# Altium project UcusKarti.PrjPcb (part 2 of 2)

## Sheet STM32.SchDoc
size A3; DocumentNumber: 4; SheetNumber: 4; SheetTotal: 5
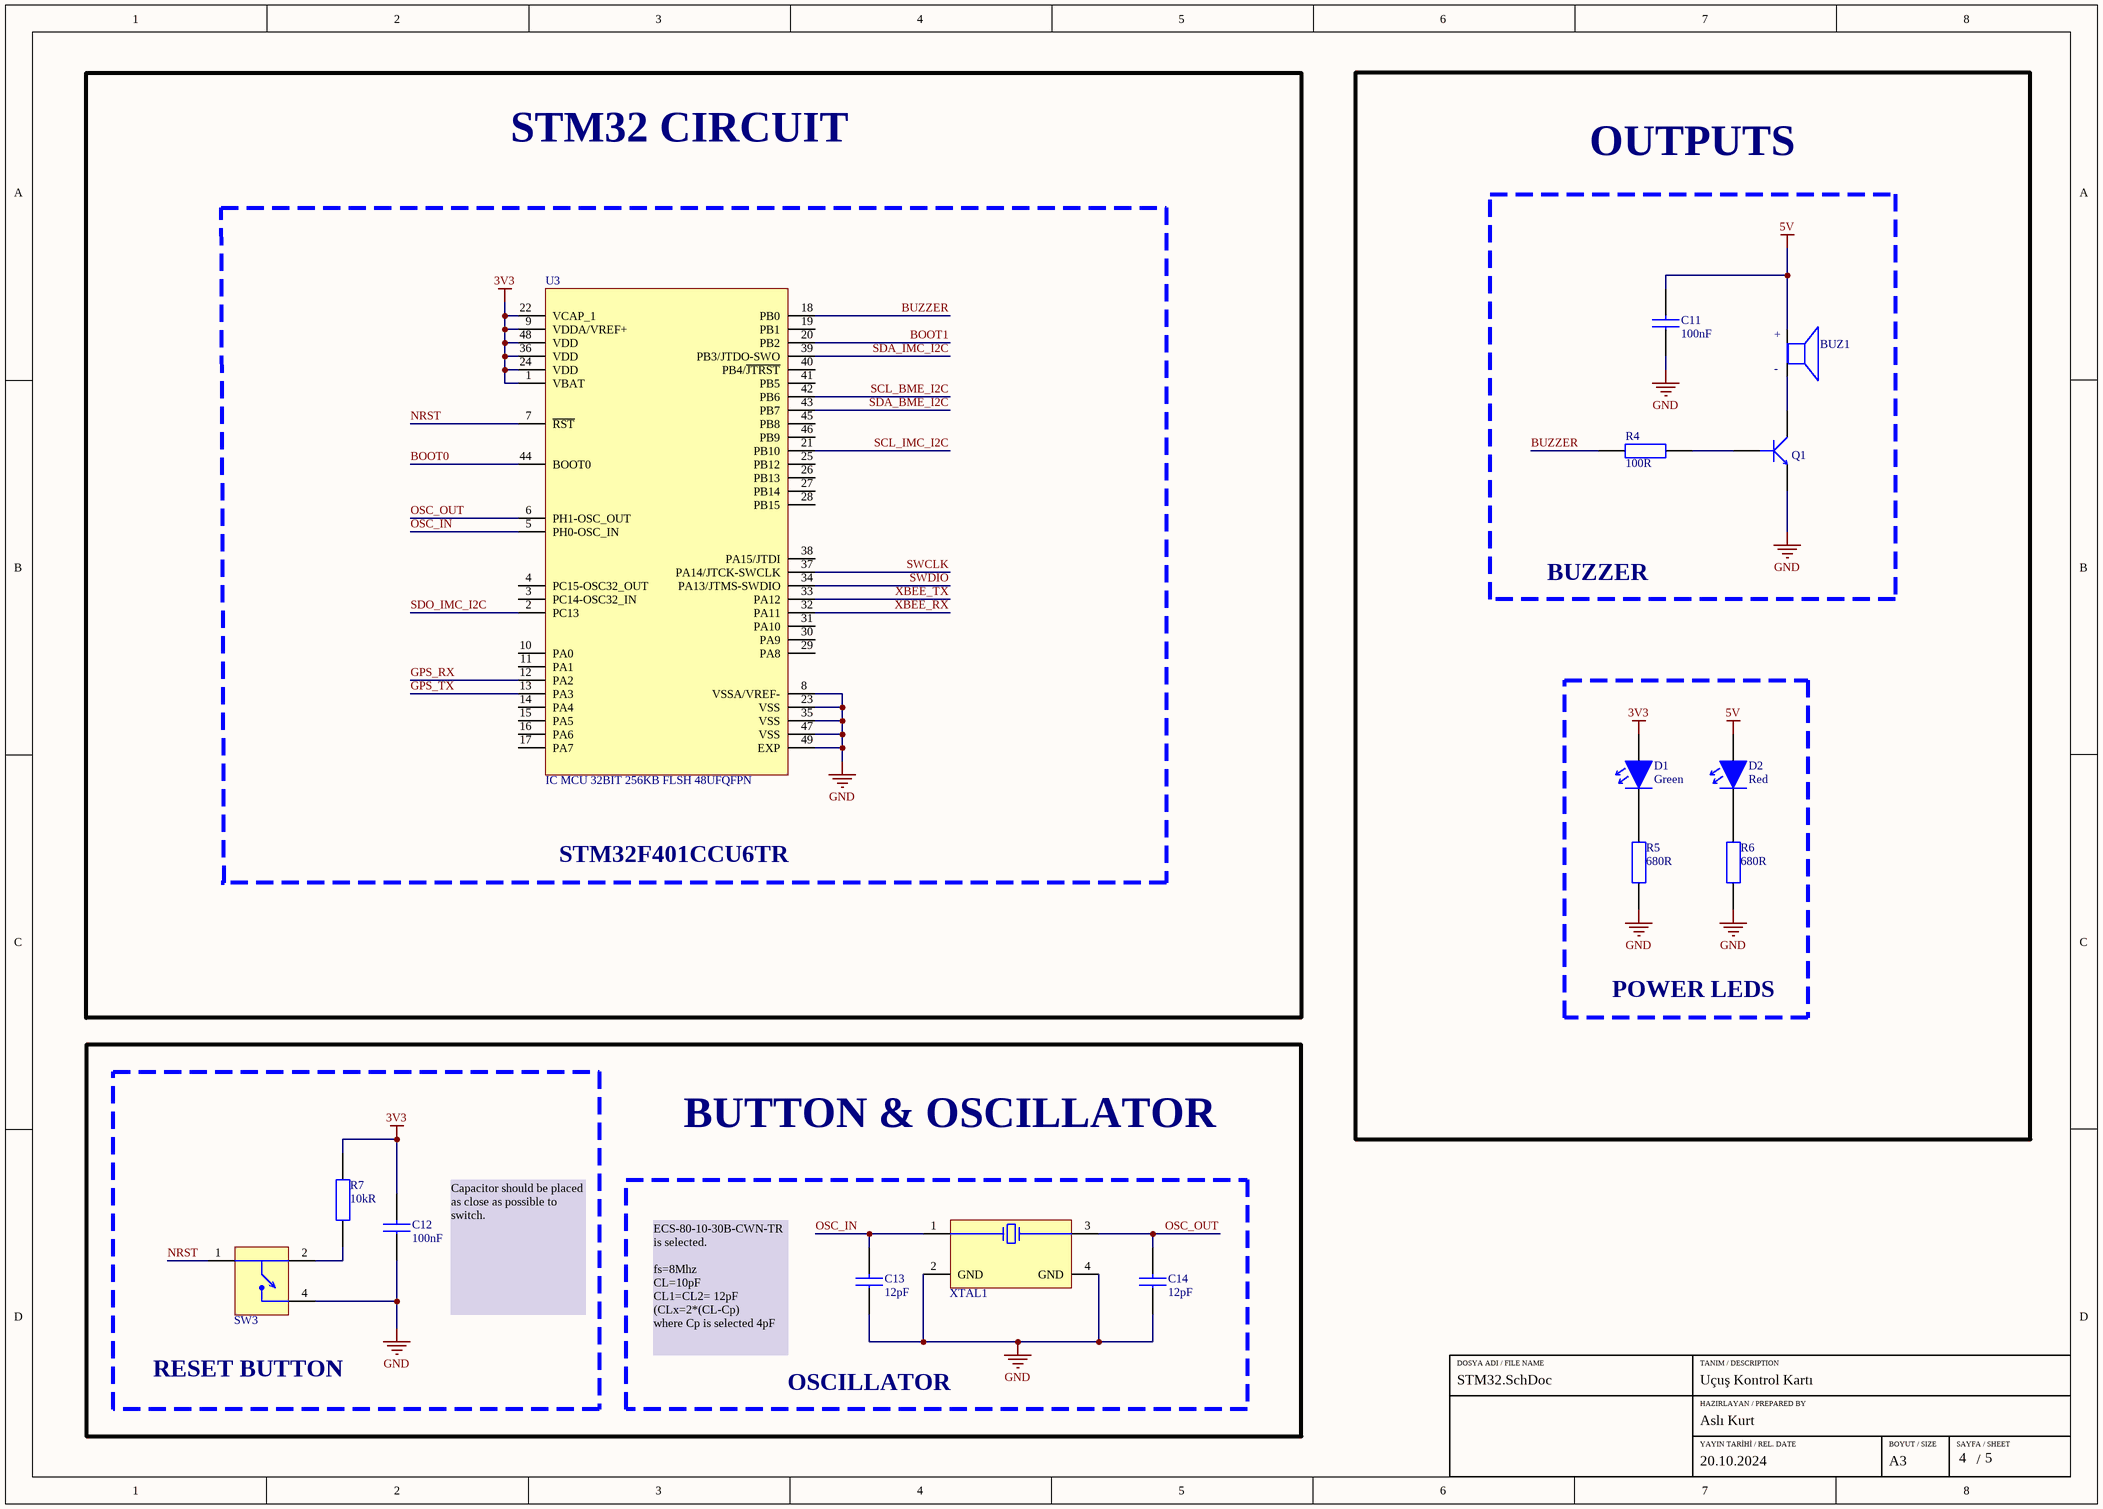
[diagram p3: STM32.SchDoc]

### Parts
BUZ1  SMI-1027-TW-5V-R  [BUZZER_SMD]  (value not drawn)
C11  Capacitance: 100nF  [CAP_0603]  (hidden comment: C0603C104K5RACTU)
C12  Capacitance: 100nF  [CAP_0603]  (hidden comment: C0603C104K5RACTU)
C13  Capacitance: 12pF  [CAP_0603]  (hidden comment: CC0603FRNPO9BN120)
C14  Capacitance: 12pF  [CAP_0603]  (hidden comment: CC0603FRNPO9BN120)
D1  Color: Green  [LED_GREEN_1206]  (hidden comment: 150120GS75000)
D2  Color: Red  [LED_RED_0805]  (hidden comment: LH R974-LP-1)
Q1  MMBT3904-7-F  [SOT-23F]  (value not drawn)
R4  Resistance: 100R  [RES_0603]  (hidden comment: RC0603JR-07100RL)
R5  Resistance: 680R  [RES_1206]  (hidden comment: RC1206FR-07680RL)
R6  Resistance: 680R  [RES_1206]  (hidden comment: RC1206FR-07680RL)
R7  Resistance: 10kR  [RES_0603]  (hidden comment: RC0603FR-0710KL)
SW3  PTS815 SJK 250 SMTR LFS  [BUTTON SMD]  (value not drawn)
U3  IC MCU 32BIT 256KB FLSH 48UFQFPN  [48-UFQFPN (7x7)]
XTAL1  ECS-80-10-30B-CWN-TR  [4-SMD, No Lead]  (value not drawn)

### Blocks framed on the sheet
STM32F401CCU6TR: U3
BUZZER: BUZ1 C11 Q1 R4
POWER LEDS: D1 D2 R5 R6
RESET BUTTON: C12 R7 SW3
OSCILLATOR: C13 C14 XTAL1

### Nets
3V3: C12.2 D1.2 R7.2 U3.1(VBAT) U3.9(VDDA/VREF+) U3.22(VCAP_1) U3.24(VDD) U3.36(VDD) U3.48(VDD)
5V: BUZ1.P(POS) C11.2 D2.2
GND: C11.1 C12.1 C13.1 C14.1 Q1.2(E) R5.1 R6.1 SW3.4 U3.8(VSSA/VREF-) U3.23(VSS) U3.35(VSS) U3.47(VSS) U3.49(EXP) XTAL1.2(GND) XTAL1.4(GND)
BOOT0: U3.44(BOOT0)
BOOT1: U3.20(PB2)
BUZZER: R4.1 U3.18(PB0)
GPS_RX: U3.12(PA2)
GPS_TX: U3.13(PA3)
NRST: SW3.1 U3.7(~{RST})
OSC_IN: C13.2 U3.5(PH0-OSC_IN) XTAL1.1
OSC_OUT: C14.2 U3.6(PH1-OSC_OUT) XTAL1.3
SCL_BME_I2C: U3.42(PB6)
SCL_IMC_I2C: U3.21(PB10)
SDA_BME_I2C: U3.43(PB7)
SDA_IMC_I2C: U3.39(PB3/JTDO-SWO)
SDO_IMC_I2C: U3.2(PC13)
SWCLK: U3.37(PA14/JTCK-SWCLK)
SWDIO: U3.34(PA13/JTMS-SWDIO)
XBEE_RX: U3.32(PA11)
XBEE_TX: U3.33(PA12)
NetBUZ1_N: BUZ1.N(NEG) Q1.3(C)
NetD1_1: D1.1 R5.2
NetD2_1: D2.1 R6.2
NetQ1_1: Q1.1(B) R4.2
NetR7_1: R7.1 SW3.2

Not connected (* = marked no-connect by the designer): U3 3(PC14-OSC32_IN) 4(PC15-OSC32_OUT) 10(PA0) 11(PA1) 14(PA4) 15(PA5) 16(PA6) 17(PA7) 19(PB1) 25(PB12) 26(PB13) 27(PB14) 28(PB15) 29(PA8) 30(PA9) 31(PA10) 38(PA15/JTDI) 40(PB4/~{JTRST}) 41(PB5) 45(PB8) 46(PB9)

### Notes on the sheet
- STM32 CIRCUIT
- OUTPUTS
- BUTTON & OSCILLATOR
- Capacitor should be placed as close as possible to switch.
- ECS-80-10-30B-CWN-TR is selected.
  fs=8Mhz
  CL=10pF
  CL1=CL2= 12pF
  (CLx=2*(CL-Cp)
  where Cp is selected 4pF
- DOSYA ADI / FILE NAME
- TANIM / DESCRIPTION
- HAZIRLAYAN / PREPARED BY
- YAYIN TARİHİ / REL. DATE
- BOYUT / SIZE
- SAYFA / SHEET
- /
- (in symbol BUZZER_5V_SMD) +; -

### Library data of the parts
BUZ1 = BUZZER_5V_SMD: Audio Indicator 5V 30mA 80dBA 2.7KHz Resonant Frequency SMD; Manufacturer: Projects Unlimited; DesignedBy: Aslı Kurt; Supplier 1: Farnell; Manufacturer Part Number: SMI-1027-TW-5V-R; RoHS: Yes; Category: Audio Products; Stock 1: 586; Pricing 1: 1=3,65, 10=2,48, 50=2,34, 100=2,19, 200=2,04, 600=2, 3000=1,96, 6000=1,92 (EUR); ComponentLink1URL: http://www.puiaudio.com/pdf/SMI-1027-TW-5V-R.pdf?src-supplier=Digikey; ComponentLink1Description: http://www.puiaudio.com/pdf/SMI-1027-TW-5V-R.pdf?src-supplier=Digikey; ComponentLink2URL: https://datasheet.octopart.com/SMI-1027-TW-5V-R-PUI-Audio-datasheet-142096096.pdf?src-supplier=Sager+Electronics; ComponentLink2Description: https://datasheet.octopart.com/SMI-1027-TW-5V-R-PUI-Audio-datasheet-142096096.pdf?src-supplier=Sager+Electronics; Supplier 2: Farnell; Stock 2: 586; Pricing 2: 150=2,19, 200=2,04, 600=2, 3000=1,96, 6000=1,92 (EUR); Supplier 3: Mouser; Stock 3: 655; Pricing 3: 1=3,48, 10=2,88, 50=2,5, 100=2,34, 1000=2,12, 10000=2,09 (USD); Supplier 4: Digikey; Stock 4: 10957; Pricing 4: 1=3,48, 10=2,877, 25=2,6548, 50=2,4932, 100=2,338, 250=2,17212, 600=1,92018 (USD); Supplier Part Number 1: 4411206; Supplier Part Number 2: 4411206RL; Supplier Part Number 3: 665-SMI1027TW5VR; Supplier Part Number 4: 668-1537-1-ND
C11 C12 = CAP CER 100nF 0603: CAP CER 100nF %10 0603 SMD; Manufacturer: KEMET; DesignedBy: Aslı Kurt; Dielectric Material: Ceramic; Voltage Rating (DC): 50V; Tolerance: 10%; Dielectric: X7R; Dissipation Factor: 2.5%; Supplier 1: Digi-Key; Manufacturer Part Number: C0603C104K5RACTU; RoHS: Yes; Category: Ceramic Capacitors; Stock 1: 1666186; Pricing 1: 1=0,12000, 10=0,08500, 50=0,04620, 100=0,03770, 500=0,02696, 1000=0,02118 (USD); Mount: Surface Mount; Case/Package: 0603; Number of Pins: 2; Case Code (Metric): 1608; Case Code (Imperial): 0603; Contact Plating: Tin,Matte; Min Operating Temperature: -55°C; Max Operating Temperature: 125°C; Packaging: Tape and Reel; Package Quantity: 1; Termination: SMD/SMT; Voltage: 50V; Voltage Rating: 50V; Series: SMD Comm X7R; Length: 0.063inch; Width: 0.031inch; Height: 0.8mm; Thickness: 0.034inch; Lead Pitch: 0.7mm; Depth: 0.8mm; Radiation Hardening: No; RoHS Compliant: Yes; REACH SVHC: No SVHC; ComponentLink1URL: https://datasheet.ciiva.com/7823/kem-c1002-x7r-smd-7823591.pdf?src-supplier=Element14; ComponentLink1Description: https://datasheet.ciiva.com/7823/kem-c1002-x7r-smd-7823591.pdf?src-supplier=Element14; ComponentLink2URL: https://datasheet.ciiva.com/14602/70095383-14602583.pdf?src-supplier=Allied+Electronics; ComponentLink2Description: https://datasheet.ciiva.com/14602/70095383-14602583.pdf?src-supplier=Allied+Electronics; ComponentLink3URL: https://datasheet.ciiva.com/5999/kem-c1002-x7r-smd-5999400.pdf?src-supplier=Farnell; ComponentLink3Description: https://datasheet.ciiva.com/5999/kem-c1002-x7r-smd-5999400.pdf?src-supplier=Farnell; ComponentLink4URL: https://datasheet.ciiva.com/7823/kem-c1002-x7r-smd-7823592.pdf?src-supplier=Element14; ComponentLink4Description: https://datasheet.ciiva.com/7823/kem-c1002-x7r-smd-7823592.pdf?src-supplier=Element14; ComponentLink5URL: https://datasheet.ciiva.com/28645/1851736-28645640.pdf?src-supplier=Element14; ComponentLink5Description: https://datasheet.ciiva.com/28645/1851736-28645640.pdf?src-supplier=Element14; ComponentLink6URL: https://datasheet.ciiva.com/14585/70095383-14585209.pdf?src-supplier=Allied+Electronics; ComponentLink6Description: https://datasheet.ciiva.com/14585/70095383-14585209.pdf?src-supplier=Allied+Electronics; Supplier Part Number 1: 399-5089-1-ND
C13 C14 = CAP CER 12pF 0603: Multilayer Ceramic Capacitor, 12 pF, 50 V, ï¿½ 1%, C0G (NP0), 0603 [1608 Metric]; Manufacturer: Yageo; Voltage Rating: 50V; Voltage: 10V; Insulation Resistance: 10GR; DesignedBy: Aslı Kurt; Supplier 1: Future Electronics; Manufacturer Part Number: CC0603FRNPO9BN120; RoHS: Yes; Category: Ceramic Capacitors; Stock 1: 4000; Pricing 1: 4000=0,0152, 12000=0,0148, 20000=0,0147, 80000=0,0142, 120000=0,014 (USD); Mount: Surface Mount; Case/Package: 0603; Case Code (Imperial): 0603; Case Code (Metric): 1608; Min Operating Temperature: -55°C; Max Operating Temperature: 125°C; Tolerance: 1%; Dielectric: C0G; Packaging: Tape and Reel; Package Quantity: 4000; Voltage Rating (DC): 50V; Termination: SMD/SMT; Series: CC; Length: 1.6mm; Width: 0.031inch; Height: 0.8mm; Thickness: 0.035inch; Depth: 0.8mm; Radiation Hardening: No; Lead Free: Lead Free; RoHS Compliant: Yes; Halogen Free: 5694HalogenFree; ComponentLink1URL: https://datasheet.ciiva.com/13386/upy-gp-np0-16v-to-50v-8-13386294.pdf?src-supplier=Mouser; ComponentLink1Description: https://datasheet.ciiva.com/13386/upy-gp-np0-16v-to-50v-8-13386294.pdf?src-supplier=Mouser; Supplier 2: Arrow Electronics; Stock 2: 68000; Pricing 2: 4000=0,0162, 8000=0,016, 24000=0,0159, 48000=0,0157, 100000=0,0155 (USD); Supplier 3: Farnell; Stock 3: 16190; Pricing 3: 500=0,0393, 1000=0,0327, 2000=0,032 (EUR); Supplier 4: Mouser; Stock 4: 38219; Pricing 4: 1=0,18, 10=0,076, 50=0,076, 100=0,044, 1000=0,035, 10000=0,023 (USD); Supplier 5: Digikey; Stock 5: 15553; Pricing 5: 1=0,16, 10=0,089, 50=0,0622, 100=0,0539, 500=0,03984, 1000=0,03547 (USD); Supplier Part Number 1: 7517501; Supplier Part Number 2: CC0603FRNPO9BN120; Supplier Part Number 3: 3764409RL; Supplier Part Number 4: 603-C0603FRNPO9BN120; Supplier Part Number 5: 311-3885-1-ND
D1 = LED GREEN 1206: WL-SMCW SMT Mono-Color Chip LED Waterclear; Manufacturer: Wurth Electronics; Lens Color: Colorless; Wavelength: 520nm; Luminous Intensity: 450mcd; Viewing Angle: 140°; Forward Voltage: 3.2V; Forward Current: 30mA; Lens Style: Clear,Flat,Rectangular; Test Current: 20mA; Lens Transparency: Clear; Max Reverse Voltage (DC): 5V; Power Dissipation: 105mW; Lens Size: 1.6mm; DesignedBy: Aslı Kurt; Supplier 1: Rs; Manufacturer Part Number: 150120GS75000; RoHS: Yes; Category: LEDs; Stock 1: 4450; Pricing 1: 500=0,119, 750=0,113, 1500=0,11, 3000=0,104 (GBP); Mount: Surface Mount; Case/Package: 1206; Case Code (Metric): 3216; Case Code (Imperial): 1206; Min Operating Temperature: -40°C; Max Operating Temperature: 85°C; Package Quantity: 1; Packaging: Cut Tape; Dominant Wavelength: 520nm; Series: WL-SMCW; Reverse Voltage: 5V; Length: 3.2mm; Width: 1.6mm; Height: 0.69mm; RoHS Compliant: Yes; Reach SVHC Compliant: Unknown; ComponentLink1URL: https://datasheet.ciiva.com/22656/150120gs75000-22656979.pdf?src-supplier=Element14; ComponentLink1Description: https://datasheet.ciiva.com/22656/150120gs75000-22656979.pdf?src-supplier=Element14; ComponentLink2URL: https://datasheet.ciiva.com/29279/759441-da-01-en-chipled-1206-w-kl-gruen-150120gs75000-29279042.pdf?src-supplier=Conrad; ComponentLink2Description: https://datasheet.ciiva.com/29279/759441-da-01-en-chipled-1206-w-kl-gruen-150120gs75000-29279042.pdf?src-supplier=Conrad; ComponentLink3URL: https://datasheet.ciiva.com/48430/150120gs75000-eng-tds-48430053.pdf?src-supplier=Distrelec; ComponentLink3Description: https://datasheet.ciiva.com/48430/150120gs75000-eng-tds-48430053.pdf?src-supplier=Distrelec; ComponentLink4URL: https://datasheet.ciiva.com/29561/150120gs75000-29561884.pdf?src-supplier=Digikey; ComponentLink4Description: https://datasheet.ciiva.com/29561/150120gs75000-29561884.pdf?src-supplier=Digikey; ComponentLink5URL: https://datasheet.ciiva.com/29561/150120gs75000-29561883.pdf?src-supplier=Digikey; ComponentLink5Description: https://datasheet.ciiva.com/29561/150120gs75000-29561883.pdf?src-supplier=Digikey; ComponentLink6URL: https://datasheet.ciiva.com/29561/150120gs75000-29561885.pdf?src-supplier=Digikey; ComponentLink6Description: https://datasheet.ciiva.com/29561/150120gs75000-29561885.pdf?src-supplier=Digikey; Supplier 2: Farnell; Stock 2: 6145; Pricing 2: 100=0,172, 500=0,156, 1000=0,153 (EUR); Supplier 3: Mouser; Stock 3: 4986; Pricing 3: 1=0,23, 10=0,225, 50=0,211, 100=0,182, 1000=0,165, 10000=0,165 (USD); Supplier 4: Digikey; Stock 4: 22547; Pricing 4: 1=0,22, 50=0,211, 100=0,182, 500=0,158 (USD); Supplier Part Number 1: 8154247P; Supplier Part Number 2: 2322085RL; Supplier Part Number 3: 710-150120GS75000; Supplier Part Number 4: 732-4990-1-ND
D2 = LED RED 0805: LED Uni-Color Hyper Red 660nm 2-Pin Chip 0805(2012Metric) T/R; Manufacturer: Osram Opto; Lens Color: White; Forward Voltage: 1.8V; Lens Style: Diffused,Flat,Colorless; Luminous Intensity: 71mcd; Viewing Angle: 160°; Forward Current: 30mA; Dominant Wavelength: 645nm; Number of Elements: 1; Test Current: 20mA; Reverse Voltage: 5V; Lens Transparency: Diffused; Luminous Flux: 0.17lm; Lens Size: 1.25mm; DesignedBy: Aslı Kurt; Supplier 1: Digi-Key; Manufacturer Part Number: LH R974-LP-1; RoHS: Yes; Category: LEDs; Stock 1: 35632; Pricing 1: 1=0,26000, 10=0,13900, 100=0,06480, 500=0,05978, 1000=0,04683, 2000=0,04584 (USD); Mount: Surface Mount; Case/Package: 0805; Number of Pins: 2; Case Code (Imperial): 0805; Case Code (Metric): 2012; Min Operating Temperature: -30°C; Max Operating Temperature: 85°C; Packaging: Tape and Reel; Illumination Color: Red; Package Quantity: 1; Series: CHipLED; Length: 2.1mm; Width: 1.25mm; Depth: 1.35mm; Radiation Hardening: No; RoHS Compliant: Yes; ComponentLink1URL: http://www.jameco.com/Jameco/Products/ProdDS/2085634.pdf?src-supplier=Jameco; ComponentLink1Description: http://www.jameco.com/Jameco/Products/ProdDS/2085634.pdf?src-supplier=Jameco; ComponentLink2URL: http://components.arrow.com/part/dataview/0323_01825492?src-supplier=Arrow+Europe; ComponentLink2Description: http://components.arrow.com/part/dataview/0323_01825492?src-supplier=Arrow+Europe; ComponentLink3URL: https://dammedia.osram.info/media/resource/hires/osram-dam-2493888/LH%20R974.pdf?src-supplier=Digi-Key; ComponentLink3Description: https://dammedia.osram.info/media/resource/hires/osram-dam-2493888/LH%20R974.pdf?src-supplier=Digi-Key; ComponentLink4URL: http://www.mouser.com/ds/2/311/LH%20R974%20-%20CHIPLED%200805-318659.pdf?src-supplier=Mouser; ComponentLink4Description: http://www.mouser.com/ds/2/311/LH%20R974%20-%20CHIPLED%200805-318659.pdf?src-supplier=Mouser; ComponentLink5URL: https://www.verical.com/server-webapp/html/getDatasheet?partID=258950&src-supplier=Verical; ComponentLink5Description: https://www.verical.com/server-webapp/html/getDatasheet?partID=258950&src-supplier=Verical; ComponentLink6URL: http://components.arrow.com/part/dataview/41971690S1077610N9133?src-supplier=Arrow+Electronics; ComponentLink6Description: http://components.arrow.com/part/dataview/41971690S1077610N9133?src-supplier=Arrow+Electronics; ComponentLink7URL: http://components.arrow.com/part/dataview/41971690S6190115N2128?src-supplier=Arrow+Electronics; ComponentLink7Description: http://components.arrow.com/part/dataview/41971690S6190115N2128?src-supplier=Arrow+Electronics; Supplier Part Number 1: 475-1415-1-ND
Q1 = MMBT3904-7-F: Transistor General Purpose BJT NPN 40 Volt 0.2A Automotive 3-Pin SOT-23; Manufacturer: Diodes Zetex; DesignedBy: Aslı Kurt; Max Power Dissipation: 300mW; Collector Emitter Voltage (VCEO): 40V; Max Collector Current: 200mA; Collector Base Voltage (VCBO): 60V; Frequency: 300MHz; hFE Min: 100; Number of Elements: 1; Emitter Base Voltage (VEBO): 6V; Collector Emitter Saturation Voltage: 300mV; Power Dissipation: 350mW; Element Configuration: Single; Supplier 1: Digi-Key; Manufacturer Part Number: MMBT3904-7-F; RoHS: Yes; Category: BJTs; Stock 1: 2393281; Pricing 1: 1=0,12000, 10=0,08600, 25=0,08280, 100=0,04660, 500=0,03664, 1000=0,02544 (USD); Mount: Surface Mount; Case/Package: SOT-23; Number of Pins: 3; Weight: 0.000282oz; Contact Plating: Tin,Matte; Min Operating Temperature: -55°C; Max Operating Temperature: 150°C; Polarity: NPN; Packaging: Tape and Reel; Package Quantity: 3000; Transition Frequency: 300MHz; Collector Emitter Breakdown Voltage: 40V; Max Breakdown Voltage: 40V; Continuous Collector Current: 200mA; Max Frequency: 300MHz; Gain Bandwidth Product: 300MHz; Series: -; Collector-emitter Voltage-Max: 300mV; Voltage Rating (DC): 40V; Length: 3.05mm; Width: 1.4mm; Height: 1mm; Radiation Hardening: No; REACH SVHC: No SVHC; Lead Free: Lead Free; RoHS Compliant: Yes; ComponentLink1URL: https://datasheet.ciiva.com/11201/ds30036-11201778.pdf?src-supplier=Avnet; ComponentLink1Description: https://datasheet.ciiva.com/11201/ds30036-11201778.pdf?src-supplier=Avnet; ComponentLink2URL: https://datasheet.ciiva.com/15138/getdatasheetpartid-53265-15138780.pdf?src-supplier=Verical; ComponentLink2Description: https://datasheet.ciiva.com/15138/getdatasheetpartid-53265-15138780.pdf?src-supplier=Verical; ComponentLink3URL: https://datasheet.ciiva.com/6361/ds30036-6361254.pdf?src-supplier=Digi-Key; ComponentLink3Description: https://datasheet.ciiva.com/6361/ds30036-6361254.pdf?src-supplier=Digi-Key; ComponentLink4URL: https://datasheet.ciiva.com/22711/1915516-22711750.pdf?src-supplier=Element14; ComponentLink4Description: https://datasheet.ciiva.com/22711/1915516-22711750.pdf?src-supplier=Element14; ComponentLink5URL: https://datasheet.ciiva.com/11198/ds30036-11198999.pdf?src-supplier=Avnet; ComponentLink5Description: https://datasheet.ciiva.com/11198/ds30036-11198999.pdf?src-supplier=Avnet; ComponentLink6URL: https://datasheet.ciiva.com/6361/ds30036-6361256.pdf?src-supplier=Digi-Key; ComponentLink6Description: https://datasheet.ciiva.com/6361/ds30036-6361256.pdf?src-supplier=Digi-Key; Supplier Part Number 1: MMBT3904-FDIDKR-ND
R4 = RES 100 OHM 0603: RES 100 %5 OHM 0603 SMD; Manufacturer: Yageo; DesignedBy: Aslı Kurt; Tolerance: 5%; Temperature Coefficient: 100ppm/°C; Voltage Rating (DC): 50V; Power Rating: 100mW; Supplier 1: Digi-Key; Manufacturer Part Number: RC0603JR-07100RL; RoHS: Yes; Category: Chip SMD Resistors; Stock 1: 4334796; Pricing 1: 1=0,10000, 10=0,01900, 100=0,00770, 1000=0,00344, 2500=0,00298 (USD); Case/Package: 0603; Number of Pins: 2; Contact Plating: Tin,Matte; Case Code (Imperial): 0603; Case Code (Metric): 1608; Size Code: 0603; Min Operating Temperature: -55°C; Max Operating Temperature: 155°C; Resistor Type: Thick Film; Packaging: Tape and Reel; Voltage Rating: 50V; Termination: SMD/SMT; Features: Moisture Resistant; Series: RC; Max Power Dissipation: 100mW; Number of Terminations: 2; Construction: Rectangular; Resistance Tolerance: 5%; Length: 1.6mm; Width: 0.8mm; Depth: 0.8mm; Radiation Hardening: No; REACH SVHC: Unknown; Lead Free: Lead Free; Military Standard: Not; RoHS Compliant: Yes; ComponentLink1URL: https://datasheet.ciiva.com/15189/getdatasheetpartid-325207-15189846.pdf?src-supplier=Verical; ComponentLink1Description: https://datasheet.ciiva.com/15189/getdatasheetpartid-325207-15189846.pdf?src-supplier=Verical; ComponentLink2URL: https://datasheet.ciiva.com/8883/pyu-rc0603-51-rohs-l-4-8883047.pdf?src-supplier=Avnet; ComponentLink2Description: https://datasheet.ciiva.com/8883/pyu-rc0603-51-rohs-l-4-8883047.pdf?src-supplier=Avnet; ComponentLink3URL: https://datasheet.ciiva.com/7746/443971-7746425.pdf?src-supplier=Element14; ComponentLink3Description: https://datasheet.ciiva.com/7746/443971-7746425.pdf?src-supplier=Element14; ComponentLink4URL: https://datasheet.ciiva.com/7746/443971-7746426.pdf?src-supplier=Element14; ComponentLink4Description: https://datasheet.ciiva.com/7746/443971-7746426.pdf?src-supplier=Element14; Supplier Part Number 1: 311-100GRCT-ND
R5 R6 = RES 680 OHM 1206: SMD Chip Resistor, 680 Ohm, ï¿½ 1%, 250 mW, 1206 [3216 Metric], Thick Film, General Purpose; Manufacturer: Yageo; Voltage Rating (AC): 200V; DesignedBy: Aslı Kurt; Supplier 1: Future Electronics; Manufacturer Part Number: RC1206FR-07680RL; RoHS: Yes; Category: Chip SMD Resistors; Stock 1: 315000; Pricing 1: 5000=0,0057, 20000=0,0055, 75000=0,0052, 200000=0,0051, 500000=0,0049 (USD); Lead Free: 5697LeadFree; ComponentLink1URL: https://datasheet.ciiva.com/11819/0900766b80c6630a-11819964.pdf?src-supplier=Rs; ComponentLink1Description: https://datasheet.ciiva.com/11819/0900766b80c6630a-11819964.pdf?src-supplier=Rs; ComponentLink2URL: https://datasheet.ciiva.com/7857/444357-7857386.pdf?src-supplier=Element14; ComponentLink2Description: https://datasheet.ciiva.com/7857/444357-7857386.pdf?src-supplier=Element14; ComponentLink3URL: https://datasheet.ciiva.com/7857/1686128-7857387.pdf?src-supplier=Element14; ComponentLink3Description: https://datasheet.ciiva.com/7857/1686128-7857387.pdf?src-supplier=Element14; ComponentLink4URL: https://datasheet.ciiva.com/7857/444357-7857388.pdf?src-supplier=Element14; ComponentLink4Description: https://datasheet.ciiva.com/7857/444357-7857388.pdf?src-supplier=Element14; ComponentLink5URL: https://datasheet.ciiva.com/46445/444357-46445718.pdf?src-supplier=Element14; ComponentLink5Description: https://datasheet.ciiva.com/46445/444357-46445718.pdf?src-supplier=Element14; ComponentLink6URL: https://datasheet.ciiva.com/17422/pyu-rc1206-51-rohs-l-4-17422460.pdf?src-supplier=Future+Electronics; ComponentLink6Description: https://datasheet.ciiva.com/17422/pyu-rc1206-51-rohs-l-4-17422460.pdf?src-supplier=Future+Electronics; Supplier 2: Rs; Stock 2: 2900; Pricing 2: 100=0,012, 1000=0,007, 2500=0,005, 5000=0,005, 10000=0,005 (GBP); Supplier 3: Avnet; Stock 3: 8860; Pricing 3: 1=0,104, 25=0,026, 50=0,021, 100=0,016 (USD); Supplier 4: Arrow Electronics; Stock 4: 830000; Pricing 4: 5000=0,0058, 10000=0,005, 25000=0,005, 50000=0,0037, 125000=0,0036 (USD); Supplier 5: Digikey; Stock 5: 2188492; Pricing 5: 1=0,1, 10=0,026, 50=0,0204, 100=0,0153, 500=0,01276, 1000=0,0102 (USD); Supplier 6: Mouser; Stock 6: 54929; Pricing 6: 1=0,1, 10=0,018, 50=0,018, 100=0,015, 1000=0,009, 10000=0,005 (USD); Supplier Part Number 1: 8645095; Supplier Part Number 6: 603-RC1206FR-07680RL; Supplier Part Number 2: 1988442; Supplier Part Number 3: 49AK3834; Supplier Part Number 4: RC1206FR-07680RL; Supplier Part Number 5: 311-680FRCT-ND
R7 = RES 10K OHM 0603: RES 10K %1 OHM 0603 SMD; Manufacturer: Yageo; DesignedBy: Aslı Kurt; Tolerance: 1%; Temperature Coefficient: 100ppm/°C; Voltage Rating (DC): 50V; Power Rating: 100mW; Voltage Rating: 75V; Supplier 1: Digi-Key; Manufacturer Part Number: RC0603FR-0710KL; RoHS: Yes; Category: Chip SMD Resistors; Stock 1: 24140601; Pricing 1: 1=0,10000, 10=0,02300, 100=0,00930, 1000=0,00417, 2500=0,00362 (USD); Case/Package: 0603; Number of Pins: 2; Case Code (Imperial): 0603; Case Code (Metric): 1608; Weight: 7.1E-05oz; Size Code: 0603; Min Operating Temperature: -55°C; Max Operating Temperature: 155°C; Resistor Type: Thick Film; Packaging: Tape and Reel; Termination: SMD/SMT; Features: Moisture Resistant; Series: RC; Max Power Dissipation: 100mW; Number of Terminations: 2; Resistance Tolerance: 1%; Construction: Rectangular; Length: 1.6mm; Width: 0.8mm; Height: 0.45mm; Depth: 0.8mm; Lead Pitch: 0.3mm; REACH SVHC: Unknown; Lead Free: Lead Free; Military Standard: Not; RoHS Compliant: Yes; ComponentLink1URL: https://datasheet.ciiva.com/7660/38590-7660789.pdf?src-supplier=Element14; ComponentLink1Description: https://datasheet.ciiva.com/7660/38590-7660789.pdf?src-supplier=Element14; ComponentLink2URL: https://datasheet.ciiva.com/15189/getdatasheetpartid-409289-15189591.pdf?src-supplier=Verical; ComponentLink2Description: https://datasheet.ciiva.com/15189/getdatasheetpartid-409289-15189591.pdf?src-supplier=Verical; ComponentLink3URL: https://datasheet.ciiva.com/46440/1868787-46440891.pdf?src-supplier=Element14; ComponentLink3Description: https://datasheet.ciiva.com/46440/1868787-46440891.pdf?src-supplier=Element14; ComponentLink4URL: https://datasheet.ciiva.com/7983/443971-7983596.pdf?src-supplier=Element14; ComponentLink4Description: https://datasheet.ciiva.com/7983/443971-7983596.pdf?src-supplier=Element14; ComponentLink5URL: https://datasheet.ciiva.com/7746/1738695-7746239.pdf?src-supplier=Element14; ComponentLink5Description: https://datasheet.ciiva.com/7746/1738695-7746239.pdf?src-supplier=Element14; ComponentLink6URL: https://datasheet.ciiva.com/22747/443971-22747519.pdf?src-supplier=Element14; ComponentLink6Description: https://datasheet.ciiva.com/22747/443971-22747519.pdf?src-supplier=Element14; Supplier Part Number 1: 311-10.0KHRCT-ND
SW3 = 4.2mm x 3.2mm BUTTON: Microminiature Top Actuated Tactile Switch Momentary SPST-NO 50mA 12VDC Surface Mount T/R; Manufacturer: ITT C&K; Contact Resistance: 100mR; Number of Positions: 2NUMBER; DesignedBy: Aslı Kurt; Supplier 1: Digikey; Manufacturer Part Number: PTS815SJK250SMTRLFS; RoHS: Yes; Category: Tactile Switches; Stock 1: 21205; Pricing 1: 1=0,22, 10=0,208, 25=0,1972, 100=0,1786, 250=0,1628, 500=0,1513, 1000=0,12908 (USD); ComponentLink1URL: http://datasheet.octopart.com/PTS815SJK250SMTRLFS-C%26K-Components-datasheet-130077068.pdf?src-supplier=Mouser; ComponentLink1Description: http://datasheet.octopart.com/PTS815SJK250SMTRLFS-C%26K-Components-datasheet-130077068.pdf?src-supplier=Mouser; ComponentLink2URL: http://datasheet.octopart.com/PTS815SJK250SMTRLFS-C%26K-Components-datasheet-130077068.pdf?src-supplier=Newark; ComponentLink2Description: http://datasheet.octopart.com/PTS815SJK250SMTRLFS-C%26K-Components-datasheet-130077068.pdf?src-supplier=Newark; ComponentLink3URL: http://datasheet.octopart.com/PTS815SJK250SMTRLFS-C%26K-Components-datasheet-130077068.pdf?src-supplier=Allied+Electronics; ComponentLink3Description: http://datasheet.octopart.com/PTS815SJK250SMTRLFS-C%26K-Components-datasheet-130077068.pdf?src-supplier=Allied+Electronics; ComponentLink4URL: http://datasheet.octopart.com/PTS815SJK250SMTRLFS-C%26K-Components-datasheet-130077068.pdf?src-supplier=Onlinecomponents.com; ComponentLink4Description: http://datasheet.octopart.com/PTS815SJK250SMTRLFS-C%26K-Components-datasheet-130077068.pdf?src-supplier=Onlinecomponents.com; ComponentLink5URL: http://datasheet.octopart.com/PTS815SJK250SMTRLFS-C%26K-Components-datasheet-130077068.pdf?src-supplier=Verical; ComponentLink5Description: http://datasheet.octopart.com/PTS815SJK250SMTRLFS-C%26K-Components-datasheet-130077068.pdf?src-supplier=Verical; ComponentLink6URL: http://datasheet.octopart.com/PTS815SJK250SMTRLFS-C%26K-Components-datasheet-130077068.pdf?src-supplier=Future+Electronics; ComponentLink6Description: http://datasheet.octopart.com/PTS815SJK250SMTRLFS-C%26K-Components-datasheet-130077068.pdf?src-supplier=Future+Electronics; ComponentLink7URL: http://datasheet.octopart.com/PTS815SJK250SMTRLFS-C%26K-Components-datasheet-130077068.pdf?src-supplier=Digikey; ComponentLink7Description: http://datasheet.octopart.com/PTS815SJK250SMTRLFS-C%26K-Components-datasheet-130077068.pdf?src-supplier=Digikey; ComponentLink8URL: http://datasheet.octopart.com/PTS815SJK250SMTRLFS-C%26K-Components-datasheet-130077068.pdf?src-supplier=Avnet; ComponentLink8Description: http://datasheet.octopart.com/PTS815SJK250SMTRLFS-C%26K-Components-datasheet-130077068.pdf?src-supplier=Avnet; ComponentLink9URL: http://datasheet.octopart.com/PTS815SJK250SMTRLFS-C%26K-Components-datasheet-130077068.pdf?src-supplier=Sager+Electronics; ComponentLink9Description: http://datasheet.octopart.com/PTS815SJK250SMTRLFS-C%26K-Components-datasheet-130077068.pdf?src-supplier=Sager+Electronics; ComponentLink10URL: http://datasheet.octopart.com/PTS815SJK250SMTRLFS-C%26K-Components-datasheet-130077068.pdf?src-supplier=NAC+Semi; ComponentLink10Description: http://datasheet.octopart.com/PTS815SJK250SMTRLFS-C%26K-Components-datasheet-130077068.pdf?src-supplier=NAC+Semi; ComponentLink11URL: http://datasheet.octopart.com/PTS815SJK250SMTRLFS-C%26K-Components-datasheet-130077068.pdf?src-supplier=LCSC; ComponentLink11Description: http://datasheet.octopart.com/PTS815SJK250SMTRLFS-C%26K-Components-datasheet-130077068.pdf?src-supplier=LCSC; ComponentLink12URL: http://datasheet.octopart.com/PTS815SJK250SMTRLFS-C%26K-Components-datasheet-130077068.pdf?src-supplier=Electro+Sonic; ComponentLink12Description: http://datasheet.octopart.com/PTS815SJK250SMTRLFS-C%26K-Components-datasheet-130077068.pdf?src-supplier=Electro+Sonic; ComponentLink13URL: http://datasheet.octopart.com/PTS815SJK250SMTRLFS-C%26K-Components-datasheet-130077068.pdf?src-supplier=TTI; ComponentLink13Description: http://datasheet.octopart.com/PTS815SJK250SMTRLFS-C%26K-Components-datasheet-130077068.pdf?src-supplier=TTI; ComponentLink14URL: https://datasheet.octopart.com/PTS815SJK250SMTRLFS-C%26K-Components-datasheet-166147782.pdf?src-supplier=TME; ComponentLink14Description: https://datasheet.octopart.com/PTS815SJK250SMTRLFS-C%26K-Components-datasheet-166147782.pdf?src-supplier=TME; Supplier Part Number 1: CKN12216-1-ND
U3 = STM32F401CCU6: MCU 32-bit STM32 ARM Cortex M4 RISC 256KB Flash 1.8V/2.5V/3.3V 48-Pin UFQFPN EP Tray; Manufacturer: STMicroelectronics; Number of A/D Converters: 1NUMBER; Number of Channels: 10NUMBER; DesignedBy: Aslı Kurt; Supplier 1: Mouser; Manufacturer Part Number: STM32F401CCU6; RoHS: Yes; Category: Microcontrollers; Stock 1: 1347; Pricing 1: 1=6,47, 10=3,86, 50=3,86, 100=3,86, 1000=3,22, 10000=2,9 (USD); Lead Free: 5697LeadFree; ComponentLink1URL: https://datasheet.ciiva.com/29719/dm00086815-29719713.pdf?src-supplier=Digikey; ComponentLink1Description: https://datasheet.ciiva.com/29719/dm00086815-29719713.pdf?src-supplier=Digikey; ComponentLink2URL: https://datasheet.ciiva.com/28647/1835718-28647843.pdf?src-supplier=Element14; ComponentLink2Description: https://datasheet.ciiva.com/28647/1835718-28647843.pdf?src-supplier=Element14; Supplier 2: Avnet; Stock 2: 1560; Pricing 2: 260=2,80829 (USD); Supplier 3: Arrow Electronics; Stock 3: 1033; Pricing 3: 1=6,3591, 10=3,8855, 50=3,8784, 100=3,346, 500=3,1051, 1000=3,0009, 2500=2,9605 (USD); Supplier 4: Farnell; Stock 4: 27372; Pricing 4: 1=6,93, 10=3,61, 25=3,48, 50=3,34, 100=3,3, 250=3,25, 500=3,21, 1000=3,16 (EUR); Supplier 5: Digikey; Stock 5: 729; Pricing 5: 1=7,4, 10=5,05, 25=4,4416, 80=3,85375, 260=3,41746, 520=3,21821, 1040=3,05277, 2600=2,90088 (USD); Supplier 6: Newark; Stock 6: 26852; Pricing 6: 1=5,87, 10=5,27, 50=4,8, 100=4,49, 500=3,13, 1000=3,11, 2500=3,08, 5000=3,03 (USD); Supplier Part Number 1: 511-STM32F401CCU6; Supplier Part Number 2: STM32F401CCU6; Supplier Part Number 3: STM32F401CCU6; Supplier Part Number 6: 39X0190; Supplier Part Number 4: 2393642; Supplier Part Number 5: 497-17426-ND
XTAL1 = ECS-80-10-30B-CWN-TR: Crystal 8MHz ±10ppm (Tol) ±15ppm (Stability) 10pF FUND 100Ohm 4-Pin Mini-SMD T/R; Manufacturer: ECS International; DesignedBy: Aslı Kurt; Supplier 1: Avnet; Manufacturer Part Number: ECS-80-10-30B-CWN-TR; RoHS: Yes; Category: LDO; Stock 1: 2000; Pricing 1: 1000=0,28356 (USD); ComponentLink1URL: https://ecsxtal.com/store/pdf/ecx_53b.pdf?src-supplier=Digikey; ComponentLink1Description: https://ecsxtal.com/store/pdf/ecx_53b.pdf?src-supplier=Digikey; ComponentLink2URL: http://www.ecsxtal.com/store/pdf/ecx_53b.pdf?src-supplier=Digikey; ComponentLink2Description: http://www.ecsxtal.com/store/pdf/ecx_53b.pdf?src-supplier=Digikey; ComponentLink3URL: https://datasheet.octopart.com/ECS-80-10-30B-CWN-TR-ECS-International-datasheet-145012644.pdf?src-supplier=Master+Electronics; ComponentLink3Description: https://datasheet.octopart.com/ECS-80-10-30B-CWN-TR-ECS-International-datasheet-145012644.pdf?src-supplier=Master+Electronics; Supplier 2: Arrow Electronics; Stock 2: 7000; Pricing 2: 1000=0,3761, 2000=0,3659 (USD); Supplier 3: Farnell; Stock 3: 1351; Pricing 3: 100=0,445, 250=0,434, 500=0,423, 1000=0,405, 5000=0,387, 10000=0,369 (EUR); Supplier 4: Mouser; Stock 4: 6496; Pricing 4: 1=0,64, 10=0,52, 50=0,52, 100=0,497, 1000=0,396, 10000=0,366 (USD); Supplier 5: Digikey; Stock 5: 15344; Pricing 5: 1=0,68, 10=0,587, 50=0,5288, 100=0,5057, 500=0,45618 (USD); Supplier Part Number 1: ECS-80-10-30B-CWN-; Supplier Part Number 3: 4059249RL; Supplier Part Number 4: 520-80-10-30B-CWNT; Supplier Part Number 5: XC2708CT-ND; Supplier Part Number 2: ECS-80-10-30B-CWN-TR

## Sheet EnviromentalElements.SchDoc
size A3; DocumentNumber: 5; SheetNumber: 5; SheetTotal: 5
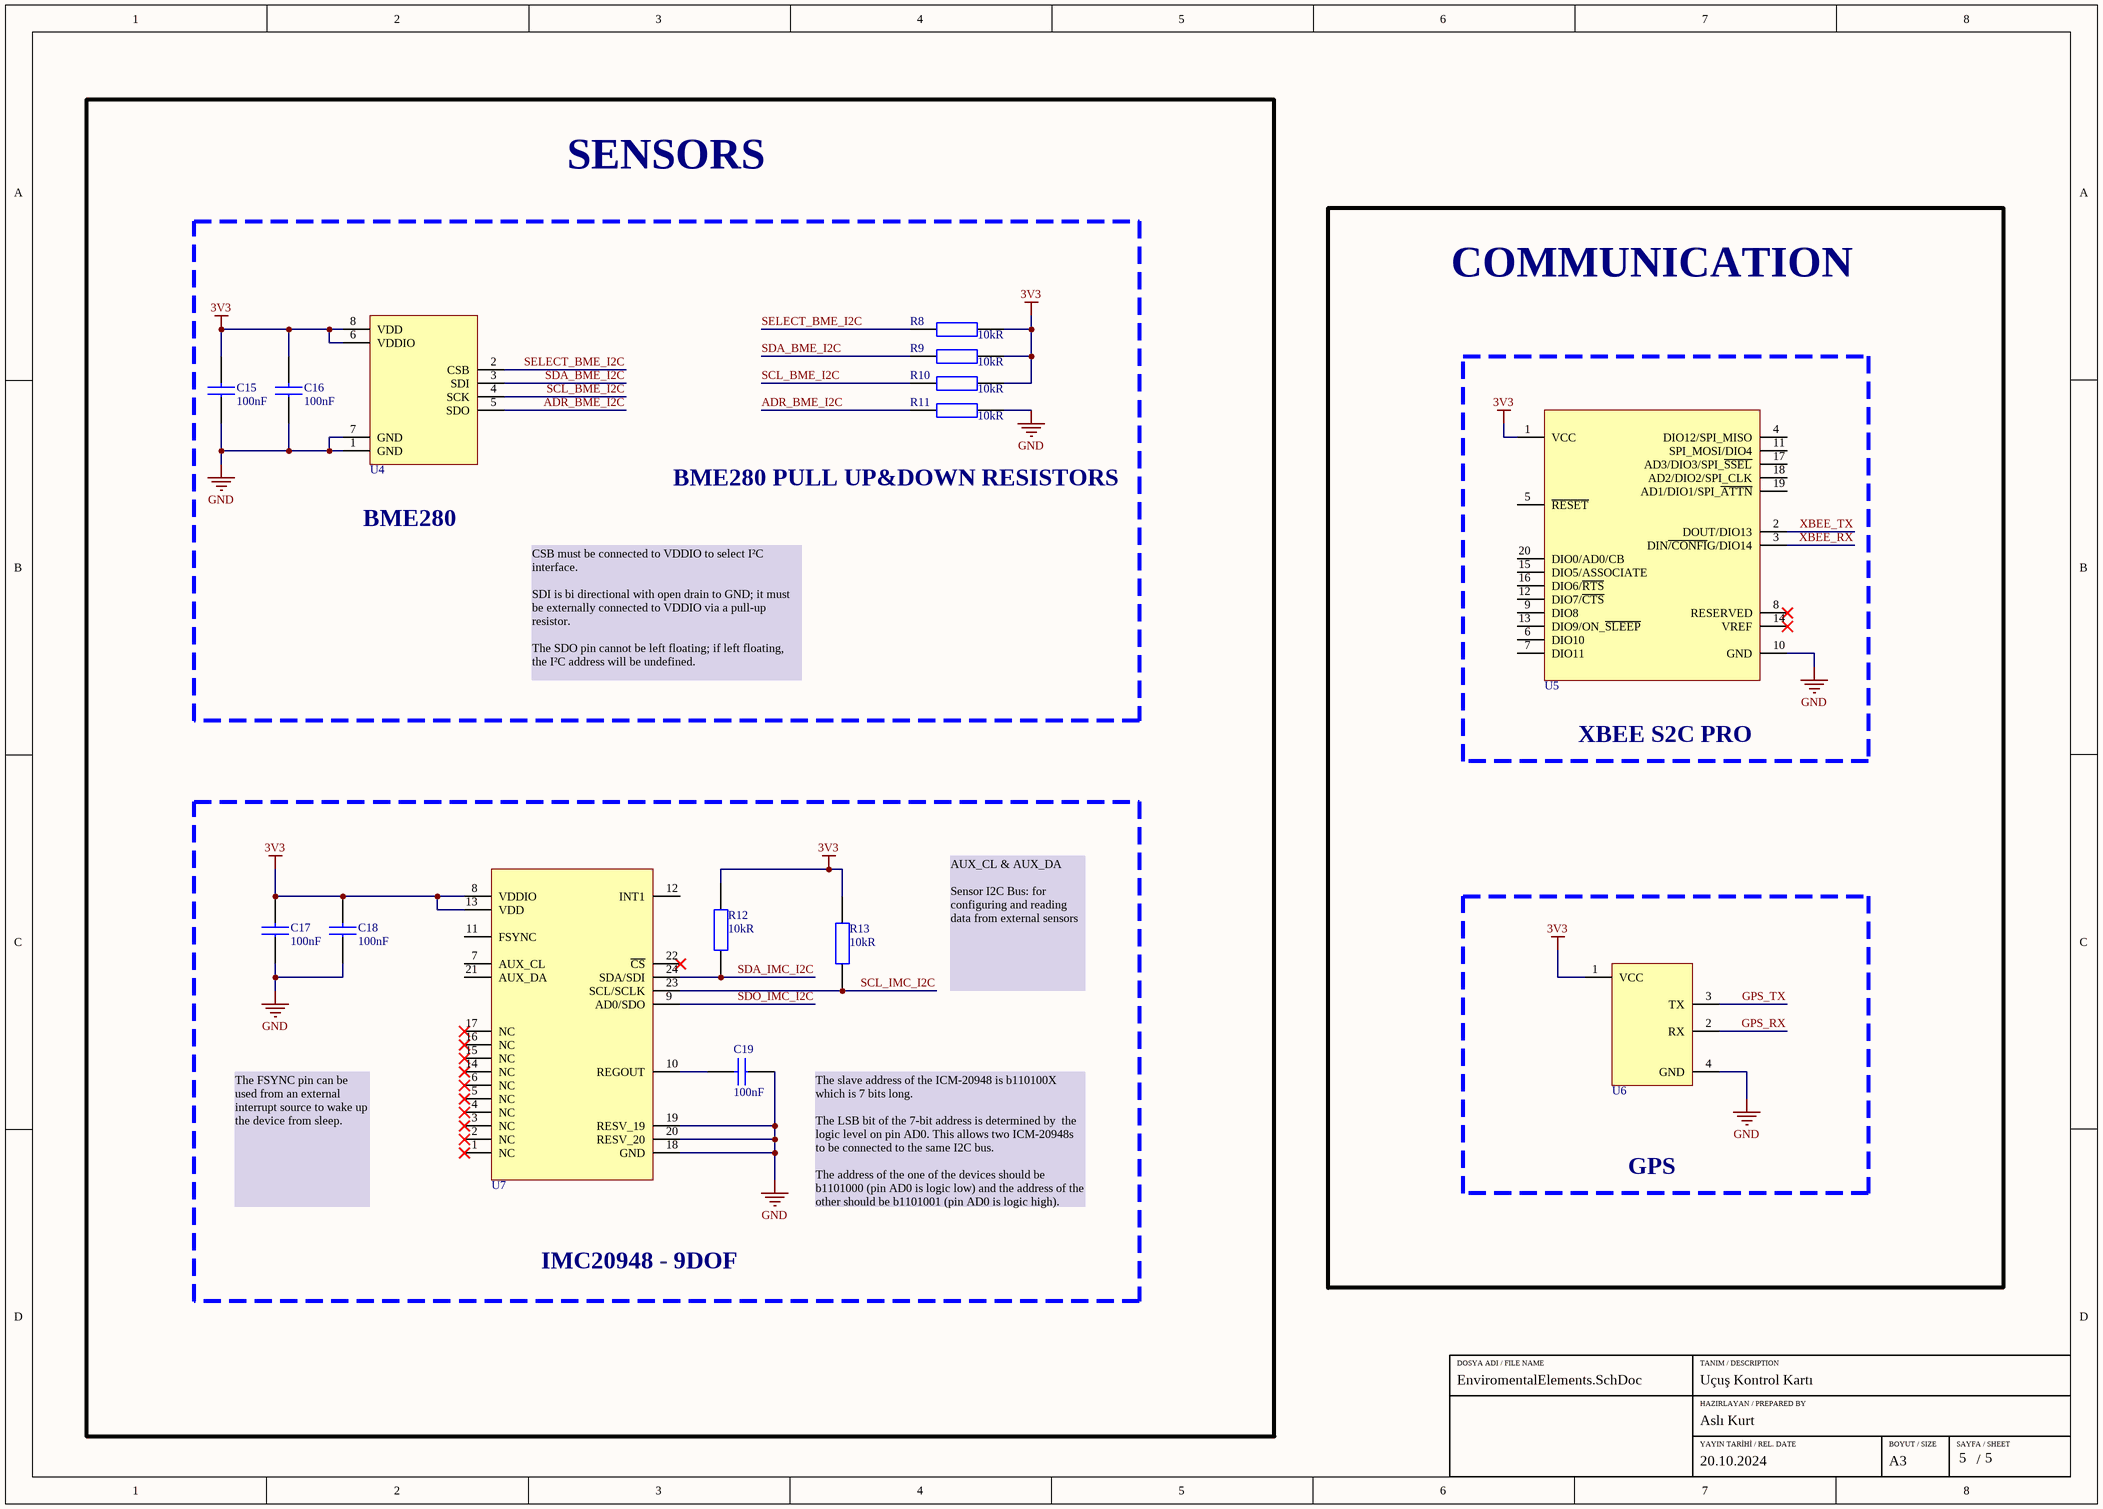
[diagram p4: EnviromentalElements.SchDoc]

### Parts
C15  Capacitance: 100nF  [CAP_0603]  (hidden comment: C0603C104K5RACTU)
C16  Capacitance: 100nF  [CAP_0603]  (hidden comment: C0603C104K5RACTU)
C17  Capacitance: 100nF  [CAP_0603]  (hidden comment: C0603C104K5RACTU)
C18  Capacitance: 100nF  [CAP_0603]  (hidden comment: C0603C104K5RACTU)
C19  Capacitance: 100nF  [CAP_0603]  (hidden comment: C0603C104K5RACTU)
R8  Resistance: 10kR  [RES_0603]  (hidden comment: RC0603FR-0710KL)
R9  Resistance: 10kR  [RES_0603]  (hidden comment: RC0603FR-0710KL)
R10  Resistance: 10kR  [RES_0603]  (hidden comment: RC0603FR-0710KL)
R11  Resistance: 10kR  [RES_0603]  (hidden comment: RC0603FR-0710KL)
R12  Resistance: 10kR  [RES_0603]  (hidden comment: RC0603FR-0710KL)
R13  Resistance: 10kR  [RES_0603]  (hidden comment: RC0603FR-0710KL)
U4  BME280  [8-VFLGA]  (value not drawn)
U5  XBEE S2C PRO  [XBEE_S2C_PRO]  (value not drawn)
U6  GY-NEO6MV2  [GY-NEO6MV2]  (value not drawn)
U7  ICM-20948  [24-TFQFN Module Exposed Pad]  (value not drawn)

### Blocks framed on the sheet
SENSORS: C15 C16 R8-R11 U4
XBEE S2C PRO: U5
IMC20948 - 9DOF: C17-C19 R12 R13 U7
GPS: U6

### Nets
3V3: C15.2 C16.2 C17.2 C18.2 R8.2 R9.2 R10.2 R12.2 R13.2 U4.6(VDDIO) U4.8(VDD) U5.1(VCC) U6.1(VCC) U7.8(VDDIO) U7.13(VDD)
GND: C15.1 C16.1 C17.1 C18.1 C19.1 R11.2 U4.1(GND) U4.7(GND) U5.10(GND) U6.4(GND) U7.18(GND) U7.19(RESV_19) U7.20(RESV_20)
ADR_BME_I2C: R11.1 U4.5(SDO)
GPS_RX: U6.2(RX)
GPS_TX: U6.3(TX)
SCL_BME_I2C: R10.1 U4.4(SCK)
SCL_IMC_I2C: R13.1 U7.23(SCL/SCLK)
SDA_BME_I2C: R9.1 U4.3(SDI)
SDA_IMC_I2C: R12.1 U7.24(SDA/SDI)
SDO_IMC_I2C: U7.9(AD0/SDO)
SELECT_BME_I2C: R8.1 U4.2(CSB)
XBEE_RX: U5.3(DIN~{/CONFI}G/DIO14)
XBEE_TX: U5.2(DOUT/DIO13)
NetC19_2: C19.2 U7.10(REGOUT)

Not connected (* = marked no-connect by the designer): U5 4(DIO12/SPI_MISO) 5(~{RESET}) 6(DIO10) 7(DIO11) 8(RESERVED)* 9(DIO8) 11(SPI_MOSI/DIO4) 12(DIO7/~{CTS}) 13(DIO9/ON_~{SLEEP}) 14(VREF)* 15(DIO5/ASSOCIATE) 16(DIO6/~{RTS}) 17(AD3/DIO3/SPI_~{SSEL}) 18(AD2/DIO2/SPI_CLK) 19(AD1/DIO1/SPI_~{ATTN}) 20(DIO0/AD0/CB); U7 1(NC)* 2(NC)* 3(NC)* 4(NC)* 5(NC)* 6(NC)* 7(AUX_CL) 11(FSYNC) 12(INT1) 14(NC)* 15(NC)* 16(NC)* 17(NC)* 21(AUX_DA) 22(~{CS})*

### Notes on the sheet
- COMMUNICATION
- BME280
- BME280 PULL UP&DOWN RESISTORS
- CSB must be connected to VDDIO to select I²C interface.
  SDI is bi directional with open drain to GND; it must be externally connected to VDDIO via a pull-up resistor.
  The SDO pin cannot be left floating; if left floating, the I²C address will be undefined.
- AUX_CL & AUX_DA
  Sensor I2C Bus: for configuring and reading data from external sensors
- The FSYNC pin can be used from an external interrupt source to wake up the device from sleep.
- The slave address of the ICM-20948 is b110100X which is 7 bits long.
  The LSB bit of the 7-bit address is determined by  the logic level on pin AD0. This allows two ICM-20948s to be connected to the same I2C bus.
  The address of the one of the devices should be b1101000 (pin AD0 is logic low) and the address of the other should be b1101001 (pin AD0 is logic high).
- DOSYA ADI / FILE NAME
- TANIM / DESCRIPTION
- HAZIRLAYAN / PREPARED BY
- YAYIN TARİHİ / REL. DATE
- BOYUT / SIZE
- SAYFA / SHEET
- /

### Library data of the parts
C15-C19 = CAP CER 100nF 0603: as C11 on sheet STM32; Supplier 1: Digi-Key; Manufacturer Part Number: C0603C104K5RACTU; RoHS: Yes; Category: Ceramic Capacitors; Stock 1: 1666186; Pricing 1: 1=0,12000, 10=0,08500, 50=0,04620, 100=0,03770, 500=0,02696, 1000=0,02118 (USD); Mount: Surface Mount; Case/Package: 0603; Number of Pins: 2; Case Code (Metric): 1608; Case Code (Imperial): 0603; Contact Plating: Tin,Matte; Min Operating Temperature: -55°C; Max Operating Temperature: 125°C; Packaging: Tape and Reel; Package Quantity: 1; Termination: SMD/SMT; Voltage: 50V; Voltage Rating: 50V; Series: SMD Comm X7R; Length: 0.063inch; Width: 0.031inch; Height: 0.8mm; Thickness: 0.034inch; Lead Pitch: 0.7mm; Depth: 0.8mm; Radiation Hardening: No; RoHS Compliant: Yes; REACH SVHC: No SVHC; ComponentLink1URL: https://datasheet.ciiva.com/7823/kem-c1002-x7r-smd-7823591.pdf?src-supplier=Element14; ComponentLink1Description: https://datasheet.ciiva.com/7823/kem-c1002-x7r-smd-7823591.pdf?src-supplier=Element14; ComponentLink2URL: https://datasheet.ciiva.com/14602/70095383-14602583.pdf?src-supplier=Allied+Electronics; ComponentLink2Description: https://datasheet.ciiva.com/14602/70095383-14602583.pdf?src-supplier=Allied+Electronics; ComponentLink3URL: https://datasheet.ciiva.com/5999/kem-c1002-x7r-smd-5999400.pdf?src-supplier=Farnell; ComponentLink3Description: https://datasheet.ciiva.com/5999/kem-c1002-x7r-smd-5999400.pdf?src-supplier=Farnell; ComponentLink4URL: https://datasheet.ciiva.com/7823/kem-c1002-x7r-smd-7823592.pdf?src-supplier=Element14; ComponentLink4Description: https://datasheet.ciiva.com/7823/kem-c1002-x7r-smd-7823592.pdf?src-supplier=Element14; ComponentLink5URL: https://datasheet.ciiva.com/28645/1851736-28645640.pdf?src-supplier=Element14; ComponentLink5Description: https://datasheet.ciiva.com/28645/1851736-28645640.pdf?src-supplier=Element14; ComponentLink6URL: https://datasheet.ciiva.com/14585/70095383-14585209.pdf?src-supplier=Allied+Electronics; ComponentLink6Description: https://datasheet.ciiva.com/14585/70095383-14585209.pdf?src-supplier=Allied+Electronics; Supplier Part Number 1: 399-5089-1-ND
R8-R13 = RES 10K OHM 0603: as R7 on sheet STM32; Supplier 1: Digi-Key; Manufacturer Part Number: RC0603FR-0710KL; RoHS: Yes; Category: Chip SMD Resistors; Stock 1: 24140601; Pricing 1: 1=0,10000, 10=0,02300, 100=0,00930, 1000=0,00417, 2500=0,00362 (USD); Case/Package: 0603; Number of Pins: 2; Case Code (Imperial): 0603; Case Code (Metric): 1608; Weight: 7.1E-05oz; Size Code: 0603; Min Operating Temperature: -55°C; Max Operating Temperature: 155°C; Resistor Type: Thick Film; Packaging: Tape and Reel; Termination: SMD/SMT; Features: Moisture Resistant; Series: RC; Max Power Dissipation: 100mW; Number of Terminations: 2; Resistance Tolerance: 1%; Construction: Rectangular; Length: 1.6mm; Width: 0.8mm; Height: 0.45mm; Depth: 0.8mm; Lead Pitch: 0.3mm; REACH SVHC: Unknown; Lead Free: Lead Free; Military Standard: Not; RoHS Compliant: Yes; ComponentLink1URL: https://datasheet.ciiva.com/7660/38590-7660789.pdf?src-supplier=Element14; ComponentLink1Description: https://datasheet.ciiva.com/7660/38590-7660789.pdf?src-supplier=Element14; ComponentLink2URL: https://datasheet.ciiva.com/15189/getdatasheetpartid-409289-15189591.pdf?src-supplier=Verical; ComponentLink2Description: https://datasheet.ciiva.com/15189/getdatasheetpartid-409289-15189591.pdf?src-supplier=Verical; ComponentLink3URL: https://datasheet.ciiva.com/46440/1868787-46440891.pdf?src-supplier=Element14; ComponentLink3Description: https://datasheet.ciiva.com/46440/1868787-46440891.pdf?src-supplier=Element14; ComponentLink4URL: https://datasheet.ciiva.com/7983/443971-7983596.pdf?src-supplier=Element14; ComponentLink4Description: https://datasheet.ciiva.com/7983/443971-7983596.pdf?src-supplier=Element14; ComponentLink5URL: https://datasheet.ciiva.com/7746/1738695-7746239.pdf?src-supplier=Element14; ComponentLink5Description: https://datasheet.ciiva.com/7746/1738695-7746239.pdf?src-supplier=Element14; ComponentLink6URL: https://datasheet.ciiva.com/22747/443971-22747519.pdf?src-supplier=Element14; ComponentLink6Description: https://datasheet.ciiva.com/22747/443971-22747519.pdf?src-supplier=Element14; Supplier Part Number 1: 311-10.0KHRCT-ND
U4 = BME280: Pressure, Temperature and Humidity Sensor Digital Output 1.8V 8-Pin LGA T/R; Manufacturer: Bosch; DesignedBy: Aslı Kurt; Supplier 1: Future Electronics; Manufacturer Part Number: BME280; RoHS: No; Category: Temperature and Humidity Sensors; Stock 1: 1497; Pricing 1: 1=4,57, 20=4,16, 150=3,89, 1000=3,63, 5000=3,41 (USD); ComponentLink1URL: https://ae-bst.resource.bosch.com/media/_tech/media/product_flyer/BME280_Productflyer_BST_20170109.pdf?src-supplier=Arrow+Electronics; ComponentLink1Description: https://ae-bst.resource.bosch.com/media/_tech/media/product_flyer/BME280_Productflyer_BST_20170109.pdf?src-supplier=Arrow+Electronics; ComponentLink2URL: https://ae-bst.resource.bosch.com/media/_tech/media/datasheets/BST-BME280-DS002.pdf?src-supplier=Digikey; ComponentLink2Description: https://ae-bst.resource.bosch.com/media/_tech/media/datasheets/BST-BME280-DS002.pdf?src-supplier=Digikey; ComponentLink3URL: https://ae-bst.resource.bosch.com/media/_tech/media/product_flyer/BME280_Productflyer_BST_20170109.pdf?src-supplier=Mouser; ComponentLink3Description: https://ae-bst.resource.bosch.com/media/_tech/media/product_flyer/BME280_Productflyer_BST_20170109.pdf?src-supplier=Mouser; ComponentLink4URL: https://ae-bst.resource.bosch.com/media/_tech/media/product_flyer/BME280_Productflyer_BST_20170109.pdf?src-supplier=NAC+Semi; ComponentLink4Description: https://ae-bst.resource.bosch.com/media/_tech/media/product_flyer/BME280_Productflyer_BST_20170109.pdf?src-supplier=NAC+Semi; ComponentLink5URL: https://datasheet.octopart.com/BME280-Bosch-Sensortec-datasheet-119732019.pdf?src-supplier=LKR; ComponentLink5Description: https://datasheet.octopart.com/BME280-Bosch-Sensortec-datasheet-119732019.pdf?src-supplier=LKR; Supplier 2: Future Electronics; Supplier Part Number 1: 2053946; Pricing 2: 10000=2,68 (USD); Supplier Part Number 2: 9052452
U5 = XB24CASIT-001: XBee S2C 802.15.4, 2.4GHz TH (RPSMA); Manufacturer: Digi International; DesignedBy: Aslı Kurt; Interface: SPI,UART; Data Rate: 1Mbps; Sensitivity: -102dBm; Current - Receiving: 31mA; Current - Transmitting: 45mA; Supplier 1: Rs; Manufacturer Part Number: XB24CASIT-001; RoHS: No; Category: RF Receivers, Transceivers; Stock 1: 10; Pricing 1: 1=39,95, 5=35,94, 10=32,4 (GBP); Mount: Through Hole; Case/Package: Module; Min Operating Temperature: -40°C; Max Operating Temperature: 85°C; Packaging: Tray; Frequency: 2.4GHz; Series: XBee®; ComponentLink1URL: https://www.digi.com/resources/documentation/digidocs/pdfs/90001500.pdf?src-supplier=Digikey; ComponentLink1Description: https://www.digi.com/resources/documentation/digidocs/pdfs/90001500.pdf?src-supplier=Digikey; Supplier 2: Digikey; Stock 2: 198; Pricing 2: 1=29,33 (USD); Supplier 3: Mouser; Pricing 3: 1=29,33, 10=29,33, 50=29,33, 100=29,33, 1000=29,33, 10000=29,33 (USD); Supplier 4: Avnet; Pricing 4: 25=29,33 (USD); Supplier 5: Arrow Electronics; Pricing 5: 25=25,77 (USD); Supplier Part Number 1: 1359726; Supplier Part Number 2: 602-1894-ND; Supplier Part Number 3: 888-XB24CASIT-001; Supplier Part Number 4: XB24CASIT-001; Supplier Part Number 5: XB24CASIT-001
U6 = GY-NEO6MV2: GY-NEO6MV2 GPS Modülü - Uçuş Kontrol Sistem GPS'i; DesignedBy: Aslı Kurt; ComponentLink1Description: Dataheet; ComponentLink1URL: https://www.rlocman.ru/i/File/2011/04/22/1.pdf
U7 = ICM-20948: Accelerometer and Gyroscope Compass 9-Axis Digital 24-Pin QFN T/R; Manufacturer: TDK; Sensor Type: Accelerometer,Gyroscope,Magnetometer; Output Type: SPI,I2C; Max Supply Voltage: 3.6V; Min Supply Voltage: 1.71V; DesignedBy: Aslı Kurt; Supplier 1: Mouser; Manufacturer Part Number: ICM-20948; RoHS: Yes; Category: Linear ICs; Stock 1: 25494; Pricing 1: 1=7,87, 10=6,16, 50=6,16, 100=5,59, 1000=4,49, 10000=4,17 (USD); Mount: Surface Mount; Case/Package: QFN; Min Operating Temperature: -40°C; Max Operating Temperature: 85°C; Series: -; Packaging: Cut Tape; Length: 3mm; Width: 3mm; Height: 1.05mm; ComponentLink1URL: http://www.farnell.com/datasheets/2632662.pdf?src-supplier=Farnell; ComponentLink1Description: http://www.farnell.com/datasheets/2632662.pdf?src-supplier=Farnell; ComponentLink2URL: https://www.invensense.com/wp-content/uploads/2016/06/App-Note-eMD-20x48-User-Guide.pdf?src-supplier=Digikey; ComponentLink2Description: https://www.invensense.com/wp-content/uploads/2016/06/App-Note-eMD-20x48-User-Guide.pdf?src-supplier=Digikey; ComponentLink3URL: http://www.farnell.com/datasheets/2632662.pdf?src-supplier=Element14; ComponentLink3Description: http://www.farnell.com/datasheets/2632662.pdf?src-supplier=Element14; ComponentLink4URL: http://www.farnell.com/datasheets/2632662.pdf?src-supplier=Newark; ComponentLink4Description: http://www.farnell.com/datasheets/2632662.pdf?src-supplier=Newark; ComponentLink5URL: https://www.invensense.com/wp-content/uploads/2016/06/App-Note-eMD-20x48-User-Guide.pdf?src-supplier=Avnet; ComponentLink5Description: https://www.invensense.com/wp-content/uploads/2016/06/App-Note-eMD-20x48-User-Guide.pdf?src-supplier=Avnet; ComponentLink6URL: https://www.invensense.com/wp-content/uploads/2016/06/App-Note-eMD-20x48-User-Guide.pdf?src-supplier=Component+Distributors+Inc.; ComponentLink6Description: https://www.invensense.com/wp-content/uploads/2016/06/App-Note-eMD-20x48-User-Guide.pdf?src-supplier=Component+Distributors+Inc.; Supplier Part Number 1: 410-ICM-20948

## Nets that join several sheets
3V3: PowerManagement (12 pins), STM32 (9 pins), EnviromentalElements (15 pins)
5V: PowerManagement (C2.2 C3.2 U1.3 U2.1), STM32 (BUZ1.P C11.2 D2.2)
GND: PowerManagement (17 pins), STM32 (15 pins), EnviromentalElements (13 pins)
BOOT0: PowerManagement (SW1.2), STM32 (U3.44)
BOOT1: PowerManagement (SW2.2), STM32 (U3.20)
GPS_RX: STM32 (U3.12), EnviromentalElements (U6.2)
GPS_TX: STM32 (U3.13), EnviromentalElements (U6.3)
NRST: PowerManagement (J2.5), STM32 (SW3.1 U3.7)
SCL_BME_I2C: STM32 (U3.42), EnviromentalElements (R10.1 U4.4)
SCL_IMC_I2C: STM32 (U3.21), EnviromentalElements (R13.1 U7.23)
SDA_BME_I2C: STM32 (U3.43), EnviromentalElements (R9.1 U4.3)
SDA_IMC_I2C: STM32 (U3.39), EnviromentalElements (R12.1 U7.24)
SDO_IMC_I2C: STM32 (U3.2), EnviromentalElements (U7.9)
SWCLK: PowerManagement (J2.2), STM32 (U3.37)
SWDIO: PowerManagement (J2.4), STM32 (U3.34)
XBEE_RX: STM32 (U3.32), EnviromentalElements (U5.3)
XBEE_TX: STM32 (U3.33), EnviromentalElements (U5.2)